# Altium schematic sheet FLS ADC_ A.SchDoc
size 558 x 401 mm; Organization: Carnegie Institution of Washington; SheetNumber: 1; SheetTotal: 0; CompanyName: Carnegie Observatories; DrawnBy: alanb; Engineer: Alan Bagish; PageSetup: Record=PageOptions|CenterHorizontal=True|CenterVertical=True|PrintScale=0.47|XCorrection=1.00|YCorrection=1.00|PrintKind=0|BorderSize=5000000|LeftOffset=0|BottomOffset=0|Orientation=2|PaperLength=1000|PaperWidth=1000|Scale=100|PaperSource=259|PrintQuality=600|MediaType=1|DitherType=10|PaperKind=Letter (8.5 x 11")|PrintScaleMode=1; DocumentName: FLS FRONT END
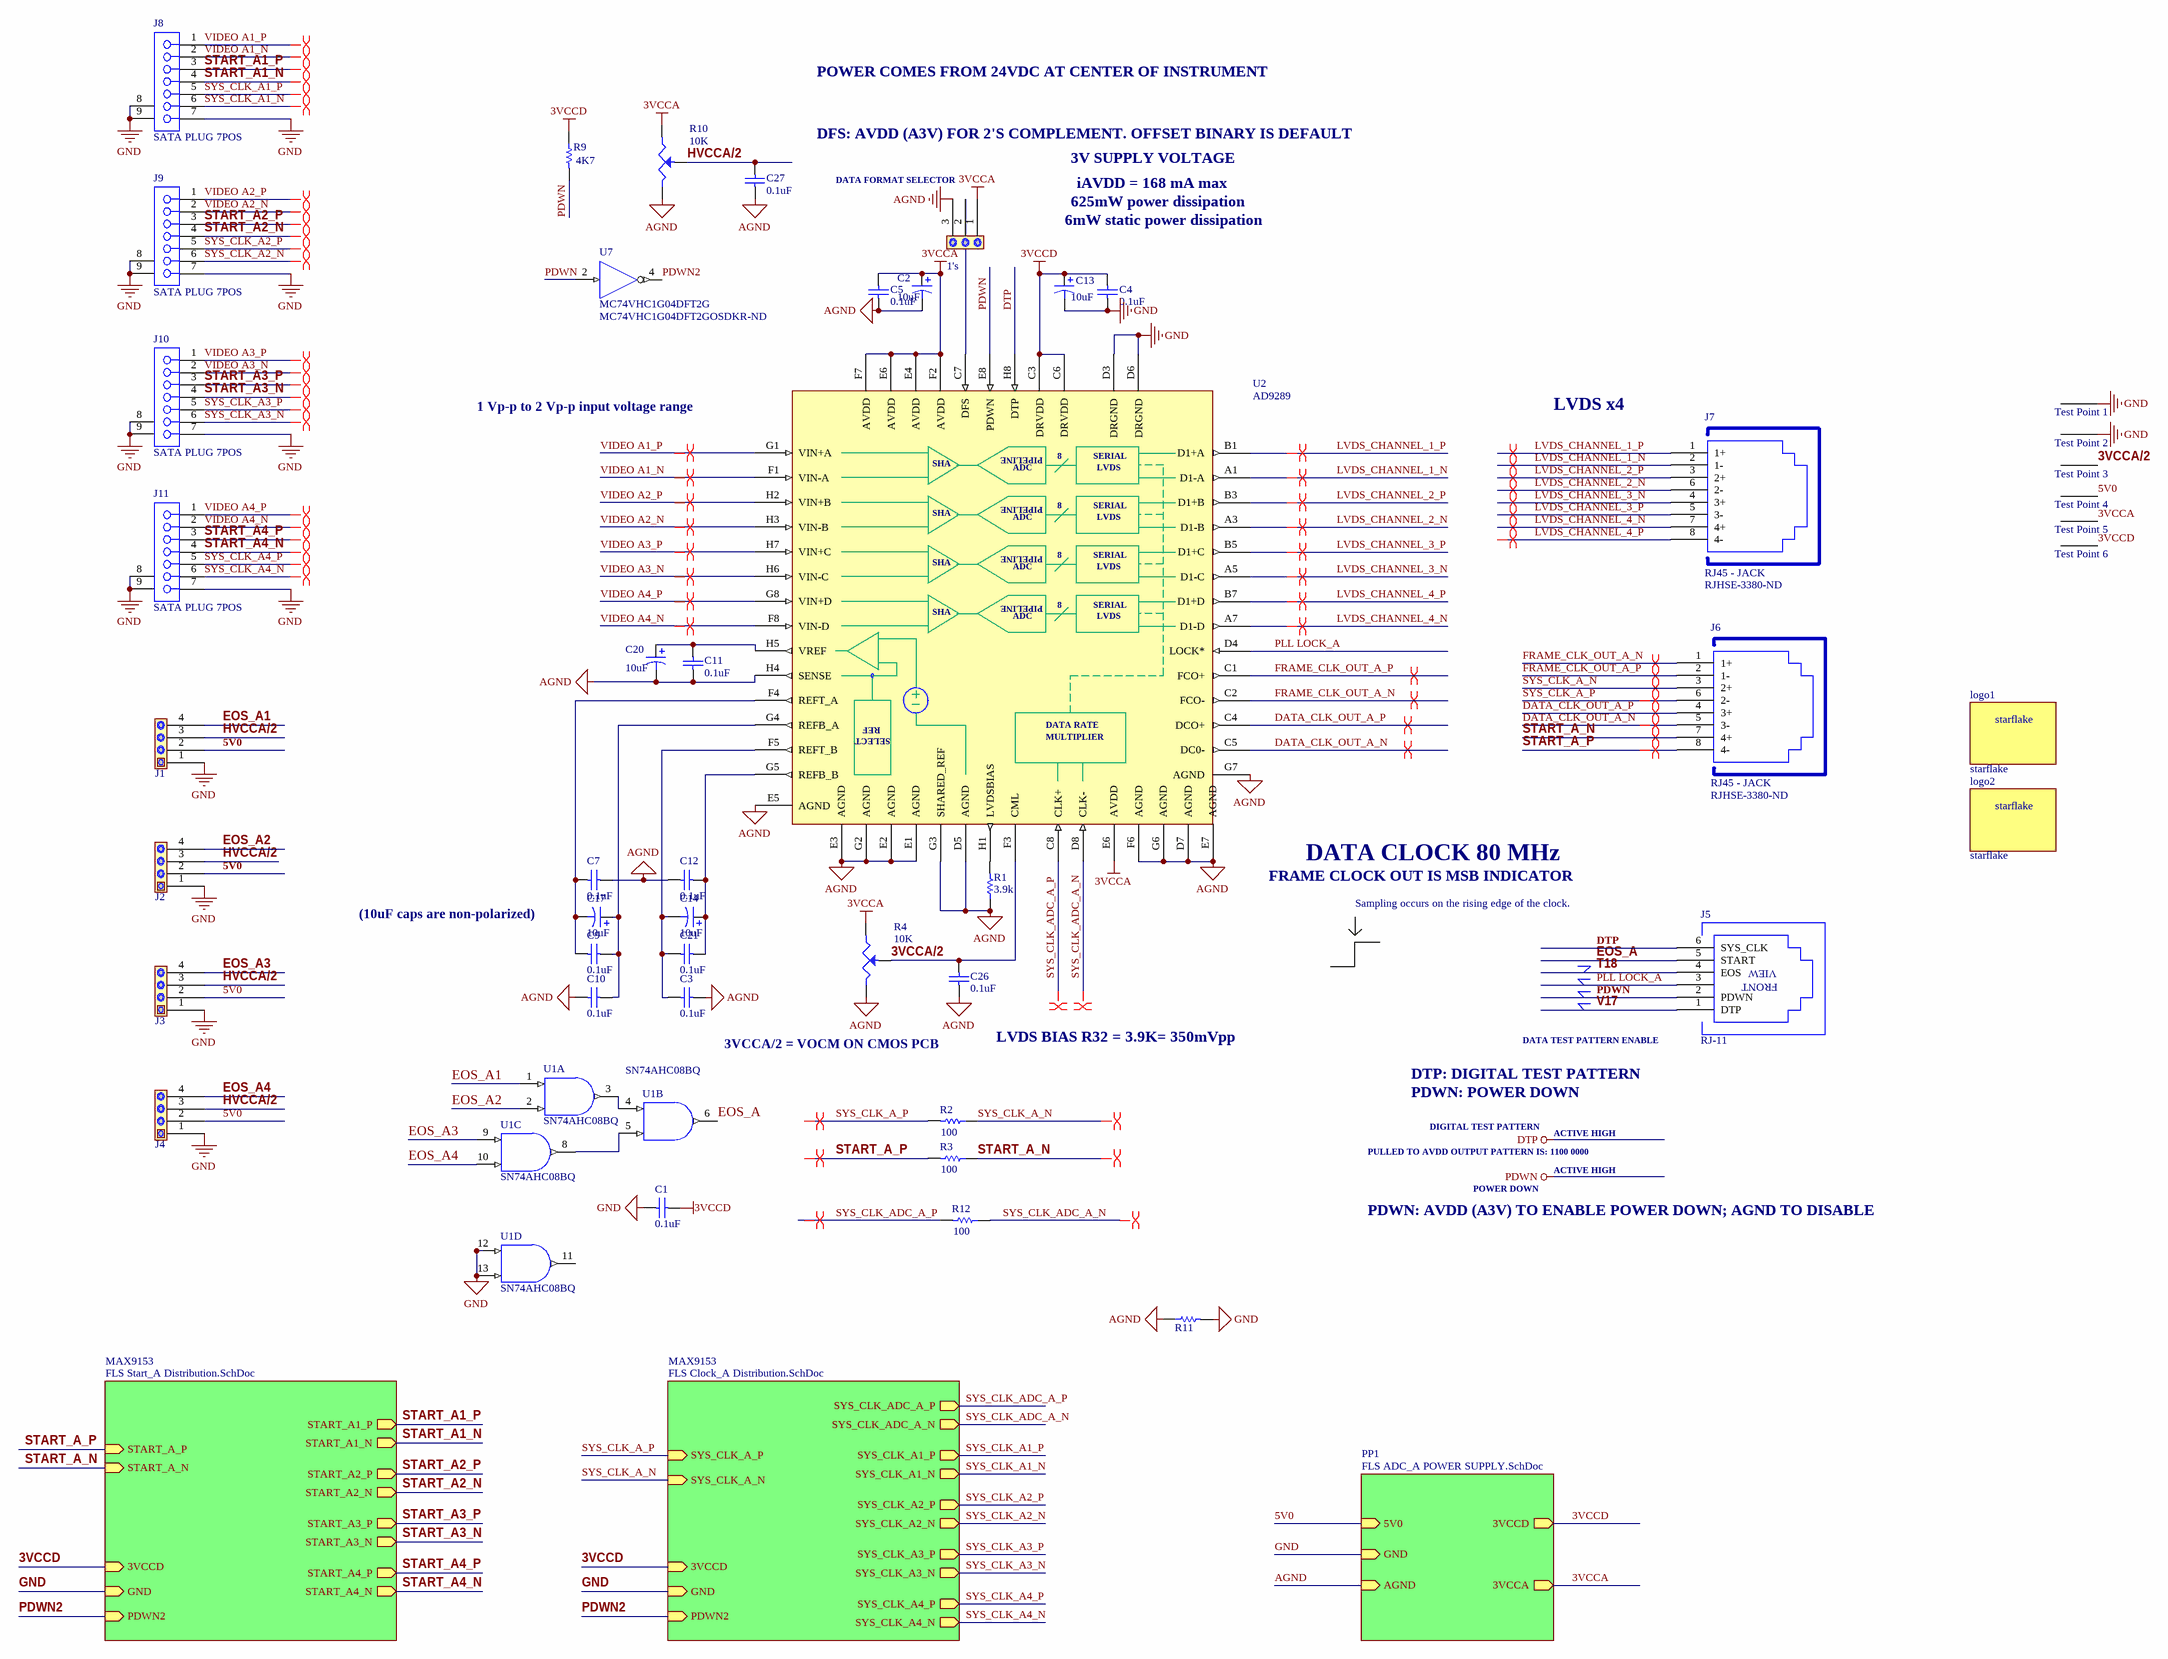
[diagram p0: FLS ADC_ A.SchDoc]

## Parts
1's  SW-SPDT  [SIP3]  (value not drawn)
C1  0.1uF  [0805 slim]
C2  10uF  [1206]
C3  0.1uF  [0805 slim]
C4  0.1uF  [0805 slim]
C5  0.1uF  [0805 slim]
C7  0.1uF  [0805 slim]
C9  0.1uF  [0805 slim]
C10  0.1uF  [0805 slim]
C11  0.1uF  [0805 slim]
C12  0.1uF  [0805 slim]
C13  10uF  [1206]
C14  10uF  [1206]
C17  10uF  [1206]
C20  10uF  [1206]
C21  0.1uF  [0805 slim]
C26  0.1uF  [0805 slim]
C27  0.1uF  [0805 slim]
J1  CON4  [SIP4]  (value not drawn)
J2  CON4  [SIP4]  (value not drawn)
J3  CON4  [SIP4]  (value not drawn)
J4  CON4  [SIP4]  (value not drawn)
J5  RJ-11  [RJ11 - Vertical]
J6  RJ45 - JACK  Supplier Part Number 1: RJHSE-3380-ND  [RJ45 Vertical Single]
J7  RJ45 - JACK  Supplier Part Number 1: RJHSE-3380-ND  [RJ45 Vertical Single]
J8  SATA PLUG 7POS  [Molex 471554001]
J9  SATA PLUG 7POS  [Molex 471554001]
J10  SATA PLUG 7POS  [Molex 471554001]
J11  SATA PLUG 7POS  [Molex 471554001]
logo1  starflake  [STARFLAKE]
logo2  starflake  [STARFLAKE]
R1  value 3.9k  [J1-0603]  (hidden comment: 100)
R2  100  [J1-0603]
R3  100  [J1-0603]
R4  10K  [V1240W]
R9  4K7  [1206]
R10  10K  [V1240W]
R11  Jumper 0805(2012)  [RESC0805(2012)_N]  (value not drawn)
R12  100  [J1-0603]
Test_Point_1  TP-107  [TP-107]  (value not drawn)
Test_Point_2  TP-107  [TP-107]  (value not drawn)
Test_Point_3  TP-107  [TP-107]  (value not drawn)
Test_Point_4  TP-107  [TP-107]  (value not drawn)
Test_Point_5  TP-107  [TP-107]  (value not drawn)
Test_Point_6  TP-107  [TP-107]  (value not drawn)
U1  SN74AHC08BQ  [DGV014]  (parts A,B,C,D of 4)
U2  AD9289  [BGA80P8X8-64B]
U7  MC74VHC1G04DFT2G  Supplier Part Number 1: MC74VHC1G04DFT2GOSDKR-ND  [419A-01_N]

## Sub-sheets
MAX9153 = FLS Clock_A Distribution.SchDoc: GND (in), 3VCCD (in), SYS_CLK_A1_P (out), SYS_CLK_A1_N (out), SYS_CLK_A2_P (out), SYS_CLK_A2_N (out), SYS_CLK_A3_P (out), SYS_CLK_A3_N (out), SYS_CLK_A4_P (out), SYS_CLK_A4_N (out), SYS_CLK_ADC_A_P (out), SYS_CLK_ADC_A_N (out), PDWN2 (in), SYS_CLK_A_P (in), SYS_CLK_A_N (in)
MAX9153 = FLS Start_A Distribution.SchDoc: GND (in), 3VCCD (in), START_A2_P (out), START_A2_N (out), START_A3_P (out), START_A3_N (out), START_A4_P (out), START_A4_N (out), START_A1_P (out), START_A1_N (out), PDWN2 (in), START_A_P (in), START_A_N (in)
PP1 = FLS ADC_A POWER SUPPLY.SchDoc: 5V0 (in), GND (in), 3VCCD (out), 3VCCA (out), AGND (in)

## Nets
3VCCA: 1's.1 C2.1 C5.1 R4.CCW R10.CCW Test_Point_5.1 U2.E4(AVDD) U2.E6(AVDD) U2.F2(AVDD) U2.F7(AVDD) ; sheet PP1/3VCCA
3VCCD: C1.2 C4.1 C13.1 R9.1 Test_Point_6.1 U1.14(VCC) U2.C3(DRVDD) U2.C6(DRVDD) U7.5(VDD) ; sheet PP1/3VCCD, sheet MAX9153/3VCCD, sheet MAX9153/3VCCD
AGND: 1's.3 C2.2 C3.2 C5.2 C7.2 C10.1 C11.2 C12.1 C20.2 C26.1 C27.1 R1.1 R4.CW R10.CW R11.1 U2.D5(AGND) U2.D7(AGND) U2.E1(AGND) U2.E2(AGND) U2.E3(AGND) U2.E5(AGND) U2.E7(AGND) U2.F6(AGND) U2.G2(AGND) U2.G3(SHARED_REF) U2.G6(AGND) U2.G7(AGND) U2.H4(SENSE) ; sheet PP1/AGND
DTP: J5.6(SYS_CLK) U2.H8(DTP)
GND: C1.1 C4.2 C13.2 J1.1 J2.1 J3.1 J4.1 J6.MH3 J6.MH4 J7.MH3 J7.MH4 J8.7 J8.8(MH1) J8.9(MH2) J9.7 J9.8(MH1) J9.9(MH2) J10.7 J10.8(MH1) J10.9(MH2) J11.7 J11.8(MH1) J11.9(MH2) R11.2 Test_Point_1.1 Test_Point_2.1 U1.7(GND) U1.12(A) U1.13(B) U2.D3(DRGND) U2.D6(DRGND) U7.3(GND) ; sheet PP1/GND, sheet MAX9153/GND, sheet MAX9153/GND
PDWN: J5.2(PDWN) R9.2 U2.E8(PDWN) U7.2(IN)
3VCCA/2: C26.2 R4.W Test_Point_3.1 U2.F3(CML)
5V0: J1.2 J2.2 J3.2 J4.2 Test_Point_4.1 ; sheet PP1/5V0
DATA_CLK_OUT_A_N: J6.5(3-) U2.C5(DC0-)
DATA_CLK_OUT_A_P: J6.4(3+) U2.C4(DCO+)
EOS_A: J5.5(START) U1.6(Y)
EOS_A1: J1.4 U1.1(A)
EOS_A2: J2.4 U1.2(B)
EOS_A3: J3.4 U1.9(A)
EOS_A4: J4.4 U1.10(B)
FRAME_CLK_OUT_A_N: J6.1(1+) U2.C2(FCO-)
FRAME_CLK_OUT_A_P: J6.2(1-) U2.C1(FCO+)
HVCCA/2: C27.2 J1.3 J2.3 J3.3 J4.3 R10.W
LVDS_CHANNEL_1_N: J7.2(1-) U2.A1(D1-A)
LVDS_CHANNEL_1_P: J7.1(1+) U2.B1(D1+A)
LVDS_CHANNEL_2_N: J7.6(2-) U2.A3(D1-B)
LVDS_CHANNEL_2_P: J7.3(2+) U2.B3(D1+B)
LVDS_CHANNEL_3_N: J7.4(3+) U2.A5(D1-C)
LVDS_CHANNEL_3_P: J7.5(3-) U2.B5(D1+C)
LVDS_CHANNEL_4_N: J7.7(4+) U2.A7(D1-D)
LVDS_CHANNEL_4_P: J7.8(4-) U2.B7(D1+D)
PDWN2: U7.4(~{OUT}) ; sheet MAX9153/PDWN2, sheet MAX9153/PDWN2
PLL LOCK_A: J5.3 U2.D4(LOCK*)
START_A1_N: J8.4 ; sheet MAX9153/START_A1_N
START_A1_P: J8.3 ; sheet MAX9153/START_A1_P
START_A2_N: J9.4 ; sheet MAX9153/START_A2_N
START_A2_P: J9.3 ; sheet MAX9153/START_A2_P
START_A3_N: J10.4 ; sheet MAX9153/START_A3_N
START_A3_P: J10.3 ; sheet MAX9153/START_A3_P
START_A4_N: J11.4 ; sheet MAX9153/START_A4_N
START_A4_P: J11.3 ; sheet MAX9153/START_A4_P
START_A_N: J6.7(4+) R3.1 ; sheet MAX9153/START_A_N
START_A_P: J6.8(4-) R3.2 ; sheet MAX9153/START_A_P
SYS_CLK_A1_N: J8.6 ; sheet MAX9153/SYS_CLK_A1_N
SYS_CLK_A1_P: J8.5 ; sheet MAX9153/SYS_CLK_A1_P
SYS_CLK_A2_N: J9.6 ; sheet MAX9153/SYS_CLK_A2_N
SYS_CLK_A2_P: J9.5 ; sheet MAX9153/SYS_CLK_A2_P
SYS_CLK_A3_N: J10.6 ; sheet MAX9153/SYS_CLK_A3_N
SYS_CLK_A3_P: J10.5 ; sheet MAX9153/SYS_CLK_A3_P
SYS_CLK_A4_N: J11.6 ; sheet MAX9153/SYS_CLK_A4_N
SYS_CLK_A4_P: J11.5 ; sheet MAX9153/SYS_CLK_A4_P
SYS_CLK_A_N: J6.3(2+) R2.1 ; sheet MAX9153/SYS_CLK_A_N
SYS_CLK_A_P: J6.6(2-) R2.2 ; sheet MAX9153/SYS_CLK_A_P
SYS_CLK_ADC_A_N: R12.1 U2.D8(CLK-) ; sheet MAX9153/SYS_CLK_ADC_A_N
SYS_CLK_ADC_A_P: R12.2 U2.C8(CLK+) ; sheet MAX9153/SYS_CLK_ADC_A_P
T18: J5.4(EOS)
V17: J5.1(DTP)
VIDEO A1_N: J8.2 U2.F1(VIN-A)
VIDEO A1_P: J8.1 U2.G1(VIN+A)
VIDEO A2_N: J9.2 U2.H3(VIN-B)
VIDEO A2_P: J9.1 U2.H2(VIN+B)
VIDEO A3_N: J10.2 U2.H6(VIN-C)
VIDEO A3_P: J10.1 U2.H7(VIN+C)
VIDEO A4_N: J11.2 U2.F8(VIN-D)
VIDEO A4_P: J11.1 U2.G8(VIN+D)
Net1's_2: 1's.2 U2.C7(DFS)
NetC3_1: C3.1 C14.2 C21.1 U2.F5(REFT_B)
NetC7_1: C7.1 C9.1 C17.2 U2.F4(REFT_A)
NetC9_2: C9.2 C10.2 C17.1 U2.G4(REFB_A)
NetC11_1: C11.1 C20.1 U2.H5(VREF)
NetC12_2: C12.2 C14.1 C21.2 U2.G5(REFB_B)
NetR1_2: R1.2 U2.H1(LVDSBIAS)
NetU1_3: U1.3(Y) U1.4(A)
NetU1_5: U1.5(B) U1.8(Y)

Not connected (* = marked no-connect by the designer): J6 MH1 MH2; J7 MH1 MH2; U1 11(Y)

## Layout directives
differential pair: DATA_CLK_OUT_A_N, DATA_CLK_OUT_A_P, FRAME_CLK_OUT_A_N, FRAME_CLK_OUT_A_P, LVDS_CHANNEL_1_N, LVDS_CHANNEL_1_P, LVDS_CHANNEL_2_N, LVDS_CHANNEL_2_P, LVDS_CHANNEL_3_N, LVDS_CHANNEL_3_P, LVDS_CHANNEL_4_N, LVDS_CHANNEL_4_P, START_A1_N, START_A1_P, START_A2_N, START_A2_P, START_A3_N, START_A3_P, START_A4_N, START_A4_P, START_A_N, START_A_P, SYS_CLK_A1_N, SYS_CLK_A1_P, SYS_CLK_A2_N, SYS_CLK_A2_P, SYS_CLK_A3_N, SYS_CLK_A3_P, SYS_CLK_A4_N, SYS_CLK_A4_P, SYS_CLK_A_N, SYS_CLK_A_P, SYS_CLK_ADC_A_N, SYS_CLK_ADC_A_P, VIDEO A1_N, VIDEO A1_P, VIDEO A2_N, VIDEO A2_P, VIDEO A3_N, VIDEO A3_P, VIDEO A4_N, VIDEO A4_P

## Notes on the sheet
- POWER COMES FROM 24VDC AT CENTER OF INSTRUMENT
- DFS: AVDD (A3V) FOR 2'S COMPLEMENT. OFFSET BINARY IS DEFAULT
- DATA FORMAT SELECTOR
- 3V SUPPLY VOLTAGE
- iAVDD = 168 mA max
- 6mW static power dissipation
- 625mW power dissipation
- 1 Vp-p to 2 Vp-p input voltage range
- LVDS x4
- FRAME CLOCK OUT IS MSB INDICATOR
- DATA CLOCK 80 MHz
- (10uF caps are non-polarized)
- Sampling occurs on the rising edge of the clock.
- 3VCCA/2 = VOCM ON CMOS PCB
- LVDS BIAS R32 = 3.9K= 350mVpp
- DATA TEST PATTERN ENABLE
- DTP: DIGITAL TEST PATTERN
- PDWN: POWER DOWN
- DIGITAL TEST PATTERN
- ACTIVE HIGH
- PULLED TO AVDD OUTPUT PATTERN IS: 1100 0000
- POWER DOWN
- PDWN: AVDD (A3V) TO ENABLE POWER DOWN; AGND TO DISABLE
- Carnegie Institution of Washington
- 813 Santa Barbara Street
- The Observatories
- PHONE (626) 577-1122               FAX (626) 795-8136
- Pasadena, California 91101
- Title:
- OCIW
- Size:
- Date:
- C
- Scale:
- Drawn By:
- Checked By:
- A. BAGISH
- alanb
- Revision:
- Sheet          of
- File:
- (in symbol AD9289) PIPELINE; 8; SERIAL; SHA; ADC; LVDS; REF; DATA RATE; SELECT; MULTIPLIER
- (in symbol RJ-11) VIEW; FRONT

## Library data of the parts
1's = TP3
C1 C3-C5 C7 C9-C12 C21 C26 C27 = Cap: Capacitor; Murata Electronics North America: GRM216F51E104ZA01D; Published: 8-Jun-2000; LatestRevisionDate: 17-Jul-2002; LatestRevisionNote: Re-released for DXP Platform.; PackageReference: RAD-0.3; Publisher: Altium Limited; Value: 0.1uF; Digi-Key: 490-1726-2-ND; Footprint: 0805
C2 C13 C14 C17 C20 = Cap Pol3: Polarized Capacitor (Surface Mount); TDK Corporation: C2012Y5V1A106Z; Description: CAP CER 10UF 10V Y5V 0805; Published: 8-Jun-2000; LatestRevisionDate: 29-May-2009; Footprint: 0805 (2012 Metric); PackageReference: C0805; Publisher: Altium Limited; PackageDescription: Chip Capacitor; Value: 10uF; Digi-Key: 445-1371-6-ND
J5 = RJ-11: RJ-11 6-PIN CONNECTOR; TE Connectivity: 5520258-3; Description: CONN MOD JACK 6-6 VERT PCB 50AU; Digi-Key Part Number: A31411-ND
J6 J7 = RJ45 - JACK: Manufacturer: Amphenol Commercial Products; Description: CONN RJ45 MOD JACK VERT SHIELD; Number of Positions/Contacts: 8p8c (RJ45, Ethernet); Manufactuer Part Number: RJHSE-3380; Digi-Key Part Number: RJHSE-3380-ND; Supplier 1: Digi-Key
R1-R3 R9 R12 = Res1: Resistor; Published: 8-Jun-2000; LatestRevisionDate: 17-Jul-2002; LatestRevisionNote: Re-released for DXP Platform.; PackageReference: AXIAL-0.3; Publisher: Altium Limited
  R2 R3 R12: Value: 100
  R9: Value: 4K7
R4 R10 = POT1: Vishay Foil Resistors (Division of Vishay Precision Group): Y405310K0000J0L; Description: TRIMMER 10K OHM 0.25W TH; Temperature Coefficient: ±10ppm/°C; Digi-Key Part Number: 804-1003-ND; Series: Accutrim 1240W
R11 = CMP-1013-00001-1: Jumper 0805 (2012 Metric); Case-EIA: 0805; Value: 0.5 Ohm; Tolerance: None; Case-Metric: 2012; Technology: SMT; Power: None
U1 = SN74AHC08DBLE: Quadruple 2-Input Positive-AND Gate; Published: 8-Jun-2000; LatestRevisionDate: 04-Mar-2005; LatestRevisionNote: Stylized 3D Model Added.; DatasheetVersion: Jul-1998; PackageVersion: May-1999; PackageReference: DB014; Publisher: Altium Limited; PackageDescription: SSOP, Plastic; 14 Leads; Body Width 5.3 mm; Pitch 0.65 mm; Code_JEDEC: MO-150-AB; ComponentLink1Description: Manufacturer Link; ComponentLink1URL: http://www.ti.com/; ComponentLink2Description: Datasheet; ComponentLink2URL: http://www-s.ti.com/sc/ds/sn74ahc08.pdf; ComponentLink3Description: Packaging Specification; ComponentLink3URL: http://focus.ti.com/lit/ml/msso002e/msso002e.pdf
U7 = MC74VHC1G04DFT1: Inverter; Note: Pin 1 is NC and is not drawn.; Published: 15-Apr-2002; LatestRevisionDate: 12-Dec-2006; LatestRevisionNote: IPC-7351 Footprint Added.; DatasheetVersion: 1999; PackageVersion: Oct-1999; PackageReference: 419A-01; Publisher: Altium Limited; PackageDescription: 5-Pin SOT-353 Package 0.65 mm Pitch, 2.1 mm Lead Span; ComponentLink1Description: Manufacturer Link; ComponentLink1URL: http://www.onsemi.com/; ComponentLink2Description: Datasheet; ComponentLink2URL: http://www.onsemi.com/pub/Collateral/MC74VHC1G04-D.PDF; Supplier 1: Digi-Key